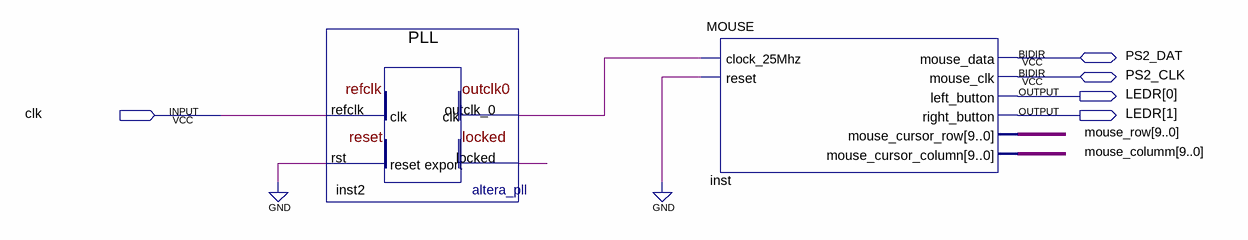
[diagram p0: schematic sheet]
// Quartus schematic trail.bdf as structural Verilog: 2 symbols, 5 pins
module trail (
  input  clk,
  inout  PS2_DAT,
  inout  PS2_CLK,
  output [1:0] LEDR
);

  wire inst2_locked, inst2_outclk_0;
  wire [9:0] mouse_columm, mouse_row;

  PLL inst2 (.refclk(clk), .rst(1'b0), .outclk_0(inst2_outclk_0), .locked(inst2_locked));
  MOUSE inst (
    .clock_25Mhz(inst2_outclk_0), .reset(1'b0), .left_button(LEDR[0]), .right_button(LEDR[1]),
    .mouse_cursor_row(mouse_row), .mouse_cursor_column(mouse_columm), .mouse_data(PS2_DAT),
    .mouse_clk(PS2_CLK));
endmodule
